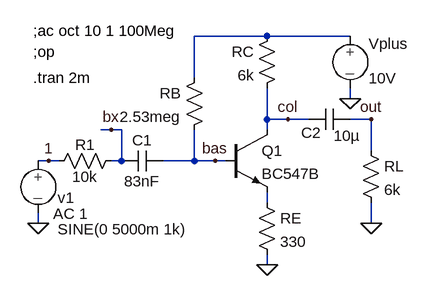
[diagram p0: schematic q1-verst-aussteuer-re.asc]
q1-verst-aussteuer-re.asc, the LTspice schematic file:
Version 4
SHEET 1 880 680
WIRE 176 -16 64 -16
WIRE 304 -16 176 -16
WIRE 64 48 64 -16
WIRE 304 80 304 64
WIRE 176 112 176 64
WIRE 208 112 176 112
WIRE 240 112 208 112
WIRE 336 112 304 112
WIRE -64 128 -80 128
WIRE -48 128 -64 128
WIRE 176 128 176 112
WIRE 336 160 336 112
WIRE -160 176 -176 176
WIRE -144 176 -160 176
WIRE -48 176 -48 128
WIRE -48 176 -64 176
WIRE 64 176 64 128
WIRE 64 176 16 176
WIRE 96 176 64 176
WIRE 112 176 96 176
WIRE 176 240 176 224
WIRE -176 272 -176 256
WIRE 336 272 336 240
WIRE 176 336 176 320
FLAG 176 336 0
FLAG 304 80 0
FLAG 96 176 bas
FLAG 208 112 col
FLAG -176 272 0
FLAG -160 176 1
FLAG 336 272 0
FLAG 336 112 out
FLAG -64 128 bx
SYMBOL EIT_Semiconductors\\npn 112 128 R0
SYMATTR InstName Q1
SYMATTR Value BC547B
SYMBOL source-V 304 -32 R0
SYMATTR InstName Vplus
SYMATTR Value 10V
SYMBOL source-V -176 160 R0
WINDOW 123 23 97 Left 2
WINDOW 39 0 0 Left 2
WINDOW 0 30 73 Left 2
WINDOW 3 30 121 Left 2
SYMATTR Value2 AC 1
SYMATTR InstName v1
SYMATTR Value SINE(0 5000m 1k)
SYMBOL res 192 -32 M0
SYMATTR InstName RC
SYMATTR Value 6k
SYMBOL cap 16 192 M270
WINDOW 0 32 32 VTop 2
WINDOW 3 0 32 VBottom 2
SYMATTR InstName C1
SYMATTR Value 83nF
SYMBOL res 80 32 M0
SYMATTR InstName RB
SYMATTR Value 2.53meg
SYMBOL res -160 192 R270
WINDOW 0 25 56 VTop 2
WINDOW 3 7 56 VBottom 2
SYMATTR InstName R1
SYMATTR Value 10k
SYMBOL cap 240 128 R270
WINDOW 0 -20 4 VTop 2
WINDOW 3 6 59 VBottom 2
SYMATTR InstName C2
SYMATTR Value 10µ
SYMBOL res 320 144 R0
SYMATTR InstName RL
SYMATTR Value 6k
SYMBOL res 160 224 R0
SYMATTR InstName RE
SYMATTR Value 330
TEXT -184 8 Left 2 !;op
TEXT -184 48 Left 2 !.tran 2m
TEXT -184 -24 Left 2 !;ac oct 10 1 100Meg

The netlist it stands for:
* q1-verst-aussteuer-re.asc
Q1 col bas N002 0 BC547B
Vplus N001 0 10V
v1 1 0 SINE(0 5000m 1k) AC 1
RC N001 col 6k
C1 bas bx 83nF
RB N001 bas 2.53meg
R1 1 bx 10k
C2 col out 10µ
RL out 0 6k
RE N002 0 330
.model NPN NPN
.model PNP PNP
.lib standard.bjt
;op
.tran 2m
;ac oct 10 1 100Meg
.backanno
.end